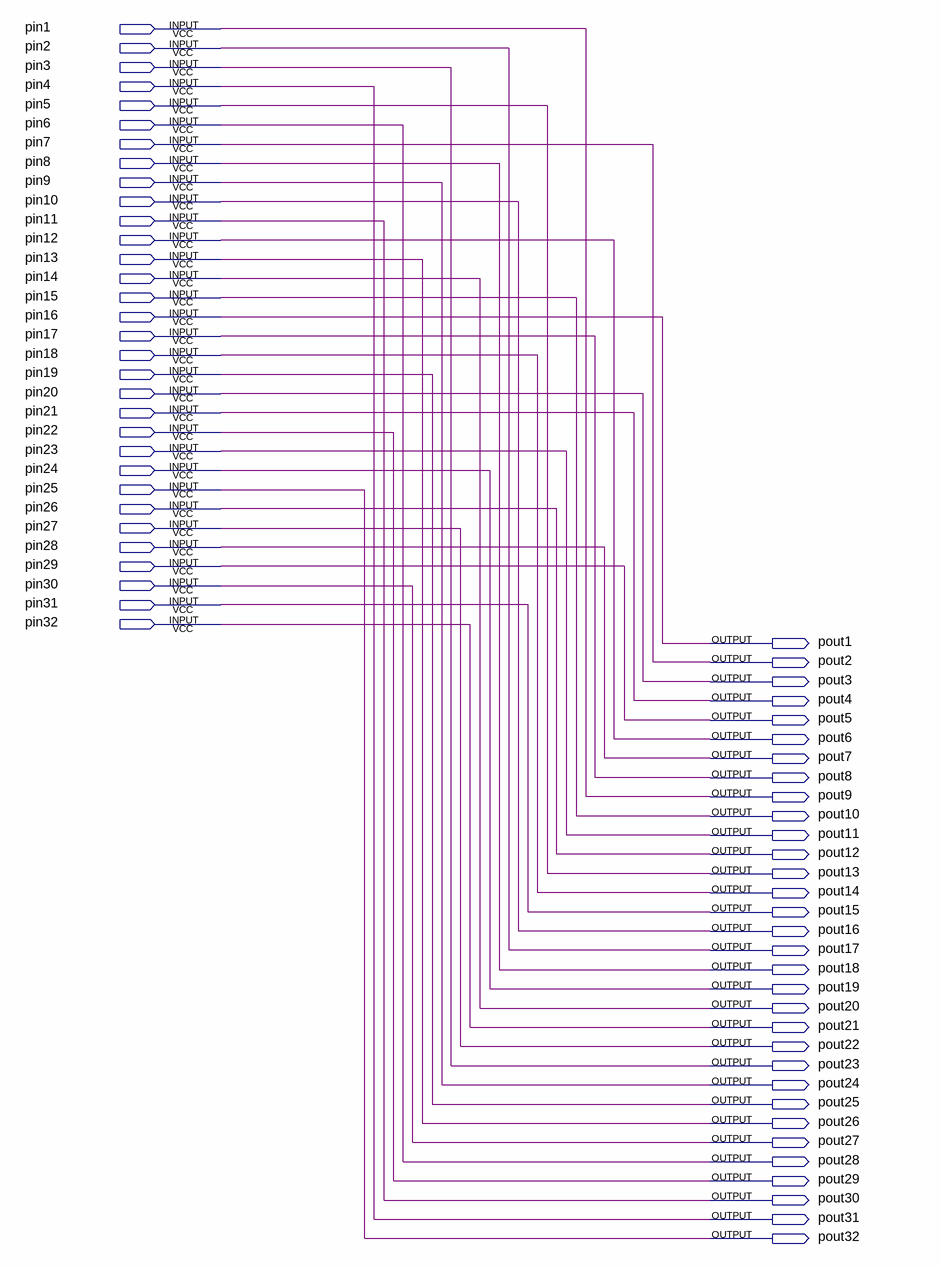
[diagram p0: schematic sheet]
// Quartus schematic P.bdf as structural Verilog: 0 symbols, 64 pins
module P (
  input  pin1,
  input  pin2,
  input  pin3,
  input  pin4,
  input  pin5,
  input  pin6,
  input  pin7,
  input  pin8,
  input  pin9,
  input  pin10,
  input  pin11,
  input  pin12,
  input  pin13,
  input  pin14,
  input  pin15,
  input  pin16,
  input  pin17,
  input  pin18,
  input  pin19,
  input  pin20,
  input  pin21,
  input  pin22,
  input  pin23,
  input  pin24,
  input  pin25,
  input  pin26,
  input  pin27,
  input  pin28,
  input  pin29,
  input  pin30,
  input  pin31,
  input  pin32,
  output pout1,
  output pout2,
  output pout3,
  output pout4,
  output pout5,
  output pout6,
  output pout7,
  output pout8,
  output pout9,
  output pout10,
  output pout11,
  output pout12,
  output pout13,
  output pout14,
  output pout15,
  output pout16,
  output pout17,
  output pout18,
  output pout19,
  output pout20,
  output pout21,
  output pout22,
  output pout23,
  output pout24,
  output pout25,
  output pout26,
  output pout27,
  output pout28,
  output pout29,
  output pout30,
  output pout31,
  output pout32
);


  assign pout1 = pin16;
  assign pout2 = pin7;
  assign pout3 = pin20;
  assign pout4 = pin21;
  assign pout5 = pin29;
  assign pout6 = pin12;
  assign pout7 = pin28;
  assign pout8 = pin17;
  assign pout9 = pin1;
  assign pout10 = pin15;
  assign pout11 = pin23;
  assign pout12 = pin26;
  assign pout13 = pin5;
  assign pout14 = pin18;
  assign pout15 = pin31;
  assign pout16 = pin10;
  assign pout17 = pin2;
  assign pout18 = pin8;
  assign pout19 = pin24;
  assign pout20 = pin14;
  assign pout21 = pin32;
  assign pout22 = pin27;
  assign pout23 = pin3;
  assign pout24 = pin9;
  assign pout25 = pin19;
  assign pout26 = pin13;
  assign pout27 = pin30;
  assign pout28 = pin6;
  assign pout29 = pin22;
  assign pout30 = pin11;
  assign pout31 = pin4;
  assign pout32 = pin25;
endmodule
